# EAGLE design esp-wroom-02_conv_board (EAGLE 7.3.0)
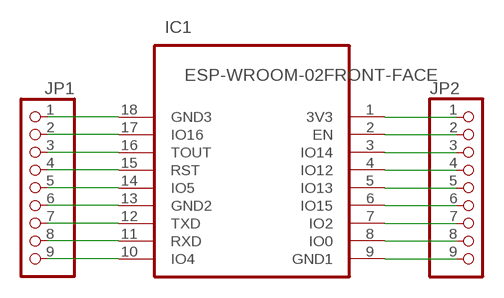
[diagram p0: schematic, sheet 1]

## Parts
IC1  ESP-WROOM-02FRONT-FACE  [FRONT-FACE]
JP1  PINHD-1X9  [1X09]
JP2  PINHD-1X9  [1X09]

## Nets
N$1: IC1.10(IO4) JP1.9
N$2: IC1.11(RXD) JP1.8
N$3: IC1.12(TXD) JP1.7
N$4: IC1.13(GND2) JP1.6
N$5: IC1.14(IO5) JP1.5
N$6: IC1.15(RST) JP1.4
N$7: IC1.16(TOUT) JP1.3
N$8: IC1.17(IO16) JP1.2
N$9: IC1.18(GND3) JP1.1
N$10: IC1.1(3V3) JP2.1
N$11: IC1.2(EN) JP2.2
N$12: IC1.3(IO14) JP2.3
N$13: IC1.4(IO12) JP2.4
N$14: IC1.5(IO13) JP2.5
N$15: IC1.6(IO15) JP2.6
N$16: IC1.7(IO2) JP2.7
N$17: IC1.8(IO0) JP2.8
N$18: IC1.9(GND1) JP2.9

## Library data of the parts
IC1 = esp-wroom-02:ESP-WROOM-02: WiFi module - ESP-WROOM-02
JP1 JP2 = pinhead:PINHD-1X9: PIN HEADER

## Board
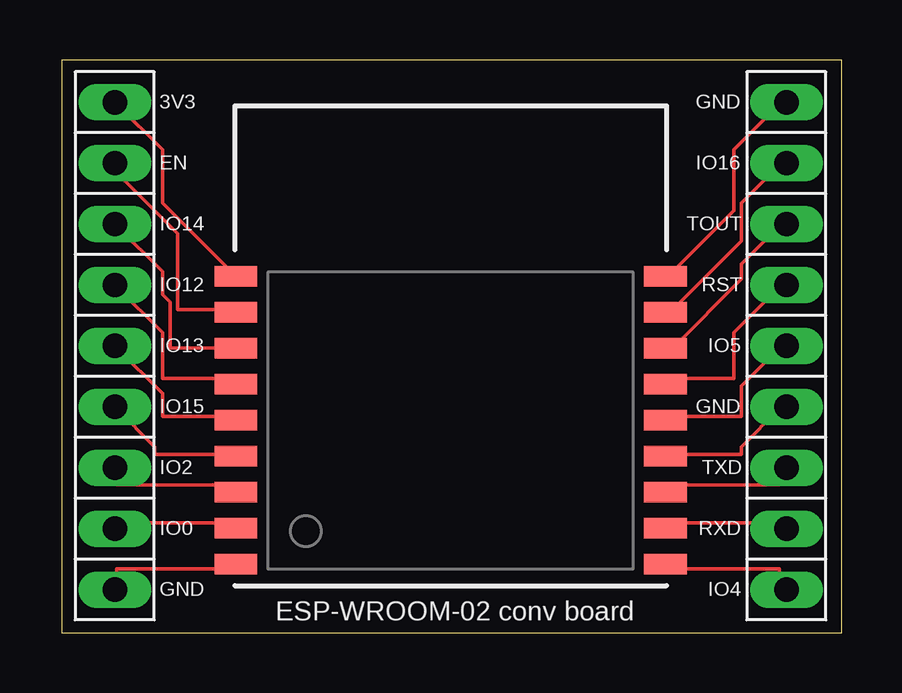
[diagram p1: board, top side]

Size 32.51 x 23.88 mm. Coordinates in mm from the lower left corner, seen from the top.
Outline: 0,0 32.51,0 32.51,23.88 0,23.88 0,0
Copper layers (1*16): Top 0.035mm / dielectric 1.5mm / Bottom 0.035mm
Design rules "SeeedStudio_2layer_DRU_no_angle_20140221a": minimum track width 6mil, minimum drill 12mil, track to track 6mil, track to pad 6mil, pad to pad 6mil, via to via 6mil, smd to smd 0mil, copper to edge 10mil, drill to drill 10mil, minimum pad ring 10mil, minimum via ring 6mil, stop-mask expansion 2mil, vias tented up to drill 25mil, thermal gap 10mil

### Footprints (pad centres in the part's own frame; a part is rotated, then mirrored left to right if it is on the bottom)
FRONT-FACE = smd 1.778 x 0.85: 1 -8.951,4.9; 2 -8.951,3.4; 3 -8.951,1.9; 4 -8.951,0.4; 5 -8.951,-1.1; 6 -8.951,-2.6; 7 -8.951,-4.1; 8 -8.951,-5.6; 9 -8.951,-7.1; 10 8.951,-7.1; 11 8.951,-5.6; 12 8.951,-4.1; 13 8.951,-2.6; 14 8.951,-1.1; 15 8.951,0.4; 16 8.951,1.9; 17 8.951,3.4; 18 8.951,4.9
1X09 = drill 1.016 long: 1 -10.16,0; 2 -7.62,0; 3 -5.08,0; 4 -2.54,0; 5 0,0; 6 2.54,0; 7 5.08,0; 8 7.62,0; 9 10.16,0

### Placement (x,y rotation side)
IC1  16.21,9.95 0 top
JP1  30.21,11.95 270 top
JP2  2.21,11.95 270 top

### Tracks (layer width: path | path; a pad name or v marks a point on that pad's centre or on a via)
N$1
  Top 0.152: IC1.10 25.46,2.67 29.91,2.67 29.91,2.03 JP1.9
N$2
  Top 0.152: IC1.11 25.46,4.57 29.91,4.57 JP1.8
N$3
  Top 0.152: IC1.12 25.46,6.16 29.91,6.16 29.91,6.79 JP1.7
N$4
  Top 0.152: IC1.13 25.46,7.43 28.32,7.43 28.32,7.75 29.91,9.34 JP1.6
N$5
  Top 0.152: IC1.14 25.46,9.02 28.32,9.02 28.32,10.29 29.91,11.87 JP1.5
N$6
  Top 0.152: IC1.15 25.46,10.6 28,10.6 28,12.51 29.91,14.41 JP1.4
N$7
  Top 0.152: IC1.16 25.46,11.87 28.32,14.73 28.32,15.37 29.91,16.95 JP1.3
N$8
  Top 0.152: IC1.17 25.46,13.46 28.32,16.32 28.32,17.91 29.91,19.49 JP1.2
N$9
  Top 0.152: IC1.18 25.46,15.05 28,17.59 28,20.13 29.91,22.04 JP1.1
N$10
  Top 0.152: IC1.1 7.05,15.05 4.19,17.91 4.19,20.13 2.29,22.04 JP2.1
N$11
  Top 0.152: IC1.2 7.05,13.46 4.83,13.46 4.83,16.64 2.29,19.18 2.29,19.49 JP2.2
N$12
  Top 0.152: IC1.3 7.05,11.87 4.51,11.87 4.51,13.78 4.19,14.1 4.19,15.05 2.29,16.95 JP2.3
N$13
  Top 0.152: IC1.4 7.05,10.6 4.19,10.6 4.19,12.51 2.29,14.41 JP2.4
N$14
  Top 0.152: IC1.5 7.05,9.02 4.19,9.02 4.19,9.97 2.29,11.87 JP2.5
N$15
  Top 0.152: IC1.6 7.05,7.43 3.87,7.43 3.87,7.75 2.29,9.34 JP2.6
N$16
  Top 0.152: IC1.7 7.05,6.16 2.29,6.16 2.29,6.79 JP2.7
N$17
  Top 0.152: IC1.8 7.05,4.57 2.29,4.57 JP2.8
N$18
  Top 0.152: IC1.9 7.05,2.67 2.29,2.67 2.29,2.03 JP2.9

### Text on the board
tNames: 3V3 | GND | EN | IO16 | IO14 | TOUT | IO12 | RST | IO13 | IO5 | IO15 | GND | IO2 | TXD | IO0 | RXD | GND | IO4 | ESP-WROOM-02 conv board